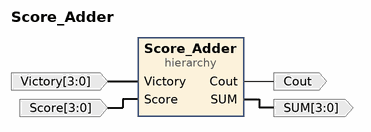
[diagram p0: block diagram of the top level]
# Vivado block design Score_Adder, xc7a35tcpg236-1, Vivado 2018.3
create_bd_design Score_Adder

create_bd_port -dir O Cout
create_bd_port -dir O -from 3 -to 0 SUM
create_bd_port -dir I -from 3 -to 0 Score
create_bd_port -dir I -from 3 -to 0 Victory

create_bd_cell -type hier Score_Adder

# ---- hierarchy /Score_Adder ----
current_bd_instance /Score_Adder
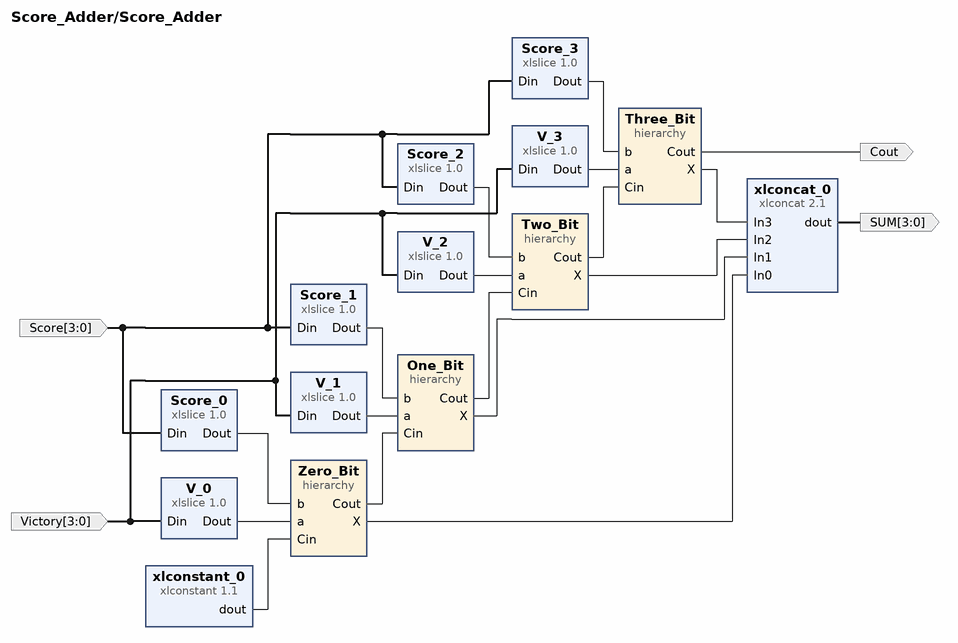
[diagram p1: block diagram inside /Score_Adder]
create_bd_pin -dir I -from 3 -to 0 Score
create_bd_pin -dir O -from 3 -to 0 SUM
create_bd_pin -dir I -from 3 -to 0 Victory
create_bd_pin -dir O Cout

create_bd_cell -type ip -vlnv xilinx.com:ip:xlslice:1.0 Score_0
set_property -dict {CONFIG.DIN_FROM 0 CONFIG.DIN_TO 0 CONFIG.DIN_WIDTH 4} [get_bd_cells Score_0]
create_bd_cell -type ip -vlnv xilinx.com:ip:xlslice:1.0 Score_1
set_property -dict {CONFIG.DIN_FROM 1 CONFIG.DIN_TO 1 CONFIG.DIN_WIDTH 4 CONFIG.DOUT_WIDTH 1} [get_bd_cells Score_1]
create_bd_cell -type ip -vlnv xilinx.com:ip:xlconcat:2.1 xlconcat_0
set_property -dict {CONFIG.NUM_PORTS 4} [get_bd_cells xlconcat_0]
create_bd_cell -type ip -vlnv xilinx.com:ip:xlslice:1.0 Score_2
set_property -dict {CONFIG.DIN_FROM 2 CONFIG.DIN_TO 2 CONFIG.DIN_WIDTH 4 CONFIG.DOUT_WIDTH 1} [get_bd_cells Score_2]
create_bd_cell -type ip -vlnv xilinx.com:ip:xlconstant:1.1 xlconstant_0
set_property -dict {CONFIG.CONST_VAL 0} [get_bd_cells xlconstant_0]
create_bd_cell -type ip -vlnv xilinx.com:ip:xlslice:1.0 Score_3
set_property -dict {CONFIG.DIN_FROM 3 CONFIG.DIN_TO 3 CONFIG.DIN_WIDTH 4 CONFIG.DOUT_WIDTH 1} [get_bd_cells Score_3]
create_bd_cell -type ip -vlnv xilinx.com:ip:xlslice:1.0 V_0
set_property -dict {CONFIG.DIN_FROM 0 CONFIG.DIN_TO 0 CONFIG.DIN_WIDTH 4} [get_bd_cells V_0]
create_bd_cell -type ip -vlnv xilinx.com:ip:xlslice:1.0 V_1
set_property -dict {CONFIG.DIN_FROM 1 CONFIG.DIN_TO 1 CONFIG.DIN_WIDTH 4 CONFIG.DOUT_WIDTH 1} [get_bd_cells V_1]
create_bd_cell -type ip -vlnv xilinx.com:ip:xlslice:1.0 V_2
set_property -dict {CONFIG.DIN_FROM 2 CONFIG.DIN_TO 2 CONFIG.DIN_WIDTH 4 CONFIG.DOUT_WIDTH 1} [get_bd_cells V_2]
create_bd_cell -type ip -vlnv xilinx.com:ip:xlslice:1.0 V_3
set_property -dict {CONFIG.DIN_FROM 3 CONFIG.DIN_TO 3 CONFIG.DIN_WIDTH 4 CONFIG.DOUT_WIDTH 1} [get_bd_cells V_3]
create_bd_cell -type hier One_Bit
create_bd_cell -type hier Three_Bit
create_bd_cell -type hier Zero_Bit
create_bd_cell -type hier Two_Bit

# ---- hierarchy /Score_Adder/One_Bit ----
current_bd_instance /Score_Adder/One_Bit
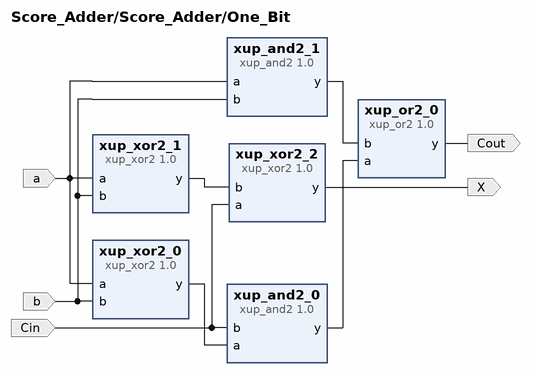
[diagram p2: block diagram inside /Score_Adder/One_Bit]
create_bd_pin -dir I a
create_bd_pin -dir I b
create_bd_pin -dir I Cin
create_bd_pin -dir O X
create_bd_pin -dir O Cout

create_bd_cell -type ip -vlnv xilinx.com:xup:xup_xor2:1.0 xup_xor2_0
set_property -dict {CONFIG.DELAY 0} [get_bd_cells xup_xor2_0]
create_bd_cell -type ip -vlnv xilinx.com:xup:xup_xor2:1.0 xup_xor2_1
set_property -dict {CONFIG.DELAY 0} [get_bd_cells xup_xor2_1]
create_bd_cell -type ip -vlnv xilinx.com:xup:xup_xor2:1.0 xup_xor2_2
set_property -dict {CONFIG.DELAY 0} [get_bd_cells xup_xor2_2]
create_bd_cell -type ip -vlnv xilinx.com:xup:xup_and2:1.0 xup_and2_0
create_bd_cell -type ip -vlnv xilinx.com:xup:xup_and2:1.0 xup_and2_1
create_bd_cell -type ip -vlnv xilinx.com:xup:xup_or2:1.0 xup_or2_0
set_property -dict {CONFIG.DELAY 0} [get_bd_cells xup_or2_0]

# ---- hierarchy /Score_Adder/Three_Bit ----
current_bd_instance /Score_Adder/Three_Bit
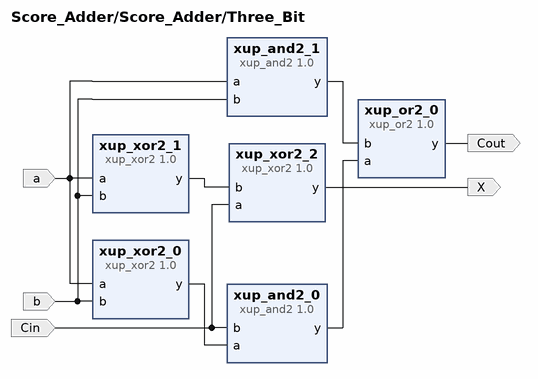
[diagram p3: block diagram inside /Score_Adder/Three_Bit]
create_bd_pin -dir I a
create_bd_pin -dir I b
create_bd_pin -dir I Cin
create_bd_pin -dir O X
create_bd_pin -dir O Cout

create_bd_cell -type ip -vlnv xilinx.com:xup:xup_xor2:1.0 xup_xor2_0
set_property -dict {CONFIG.DELAY 0} [get_bd_cells xup_xor2_0]
create_bd_cell -type ip -vlnv xilinx.com:xup:xup_xor2:1.0 xup_xor2_1
set_property -dict {CONFIG.DELAY 0} [get_bd_cells xup_xor2_1]
create_bd_cell -type ip -vlnv xilinx.com:xup:xup_xor2:1.0 xup_xor2_2
set_property -dict {CONFIG.DELAY 0} [get_bd_cells xup_xor2_2]
create_bd_cell -type ip -vlnv xilinx.com:xup:xup_and2:1.0 xup_and2_0
create_bd_cell -type ip -vlnv xilinx.com:xup:xup_and2:1.0 xup_and2_1
create_bd_cell -type ip -vlnv xilinx.com:xup:xup_or2:1.0 xup_or2_0
set_property -dict {CONFIG.DELAY 0} [get_bd_cells xup_or2_0]

# ---- hierarchy /Score_Adder/Zero_Bit ----
current_bd_instance /Score_Adder/Zero_Bit
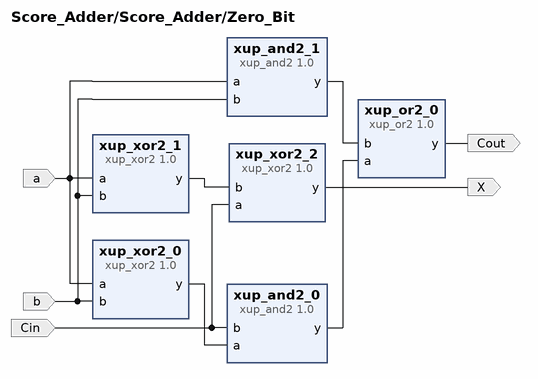
[diagram p4: block diagram inside /Score_Adder/Zero_Bit]
create_bd_pin -dir I a
create_bd_pin -dir I b
create_bd_pin -dir I Cin
create_bd_pin -dir O X
create_bd_pin -dir O Cout

create_bd_cell -type ip -vlnv xilinx.com:xup:xup_xor2:1.0 xup_xor2_0
set_property -dict {CONFIG.DELAY 0} [get_bd_cells xup_xor2_0]
create_bd_cell -type ip -vlnv xilinx.com:xup:xup_xor2:1.0 xup_xor2_1
set_property -dict {CONFIG.DELAY 0} [get_bd_cells xup_xor2_1]
create_bd_cell -type ip -vlnv xilinx.com:xup:xup_xor2:1.0 xup_xor2_2
set_property -dict {CONFIG.DELAY 0} [get_bd_cells xup_xor2_2]
create_bd_cell -type ip -vlnv xilinx.com:xup:xup_and2:1.0 xup_and2_0
create_bd_cell -type ip -vlnv xilinx.com:xup:xup_and2:1.0 xup_and2_1
create_bd_cell -type ip -vlnv xilinx.com:xup:xup_or2:1.0 xup_or2_0
set_property -dict {CONFIG.DELAY 0} [get_bd_cells xup_or2_0]

# ---- hierarchy /Score_Adder/Two_Bit ----
current_bd_instance /Score_Adder/Two_Bit
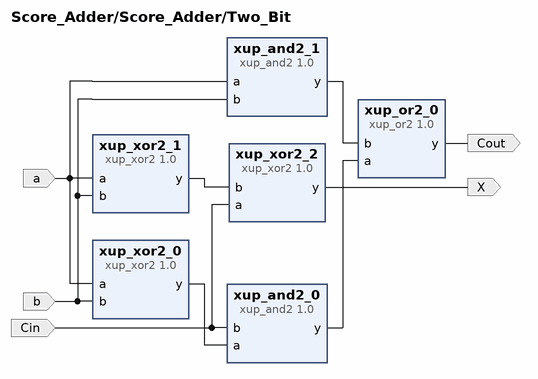
[diagram p5: block diagram inside /Score_Adder/Two_Bit]
create_bd_pin -dir I a
create_bd_pin -dir I b
create_bd_pin -dir I Cin
create_bd_pin -dir O X
create_bd_pin -dir O Cout

create_bd_cell -type ip -vlnv xilinx.com:xup:xup_xor2:1.0 xup_xor2_0
set_property -dict {CONFIG.DELAY 0} [get_bd_cells xup_xor2_0]
create_bd_cell -type ip -vlnv xilinx.com:xup:xup_xor2:1.0 xup_xor2_1
set_property -dict {CONFIG.DELAY 0} [get_bd_cells xup_xor2_1]
create_bd_cell -type ip -vlnv xilinx.com:xup:xup_xor2:1.0 xup_xor2_2
set_property -dict {CONFIG.DELAY 0} [get_bd_cells xup_xor2_2]
create_bd_cell -type ip -vlnv xilinx.com:xup:xup_and2:1.0 xup_and2_0
create_bd_cell -type ip -vlnv xilinx.com:xup:xup_and2:1.0 xup_and2_1
create_bd_cell -type ip -vlnv xilinx.com:xup:xup_or2:1.0 xup_or2_0
set_property -dict {CONFIG.DELAY 0} [get_bd_cells xup_or2_0]

# ---- connections ----

current_bd_instance /Score_Adder
connect_bd_net [get_bd_pins Score_0/Dout] [get_bd_pins Zero_Bit/b]
connect_bd_net [get_bd_pins Score_1/Dout] [get_bd_pins One_Bit/b]
connect_bd_net [get_bd_pins Zero_Bit/X] [get_bd_pins xlconcat_0/In0]
connect_bd_net [get_bd_pins One_Bit/X] [get_bd_pins xlconcat_0/In1]
connect_bd_net [get_bd_pins Two_Bit/X] [get_bd_pins xlconcat_0/In2]
connect_bd_net [get_bd_pins Three_Bit/X] [get_bd_pins xlconcat_0/In3]
connect_bd_net [get_bd_pins Score_2/Dout] [get_bd_pins Two_Bit/b]
connect_bd_net [get_bd_pins xlconstant_0/dout] [get_bd_pins Zero_Bit/Cin]
connect_bd_net [get_bd_pins Score_3/Dout] [get_bd_pins Three_Bit/b]
connect_bd_net [get_bd_pins V_0/Dout] [get_bd_pins Zero_Bit/a]
connect_bd_net [get_bd_pins V_1/Dout] [get_bd_pins One_Bit/a]
connect_bd_net [get_bd_pins V_2/Dout] [get_bd_pins Two_Bit/a]
connect_bd_net [get_bd_pins V_3/Dout] [get_bd_pins Three_Bit/a]
connect_bd_net [get_bd_pins Zero_Bit/Cout] [get_bd_pins One_Bit/Cin]
connect_bd_net [get_bd_pins One_Bit/Cout] [get_bd_pins Two_Bit/Cin]
connect_bd_net [get_bd_pins Two_Bit/Cout] [get_bd_pins Three_Bit/Cin]
connect_bd_net [get_bd_pins Score] [get_bd_pins Score_1/Din] [get_bd_pins Score_2/Din] [get_bd_pins Score_3/Din] [get_bd_pins Score_0/Din]
connect_bd_net [get_bd_pins xlconcat_0/dout] [get_bd_pins SUM]
connect_bd_net [get_bd_pins Victory] [get_bd_pins V_1/Din] [get_bd_pins V_2/Din] [get_bd_pins V_3/Din] [get_bd_pins V_0/Din]
connect_bd_net [get_bd_pins Three_Bit/Cout] [get_bd_pins Cout]

current_bd_instance /Score_Adder/One_Bit
connect_bd_net [get_bd_pins xup_xor2_0/y] [get_bd_pins xup_and2_0/a]
connect_bd_net [get_bd_pins xup_xor2_1/y] [get_bd_pins xup_xor2_2/b]
connect_bd_net [get_bd_pins xup_and2_0/y] [get_bd_pins xup_or2_0/a]
connect_bd_net [get_bd_pins xup_and2_1/y] [get_bd_pins xup_or2_0/b]
connect_bd_net [get_bd_pins a] [get_bd_pins xup_xor2_1/a] [get_bd_pins xup_and2_1/a] [get_bd_pins xup_xor2_0/a]
connect_bd_net [get_bd_pins b] [get_bd_pins xup_xor2_1/b] [get_bd_pins xup_and2_1/b] [get_bd_pins xup_xor2_0/b]
connect_bd_net [get_bd_pins Cin] [get_bd_pins xup_and2_0/b] [get_bd_pins xup_xor2_2/a]
connect_bd_net [get_bd_pins xup_xor2_2/y] [get_bd_pins X]
connect_bd_net [get_bd_pins xup_or2_0/y] [get_bd_pins Cout]

current_bd_instance /Score_Adder/Three_Bit
connect_bd_net [get_bd_pins xup_xor2_0/y] [get_bd_pins xup_and2_0/a]
connect_bd_net [get_bd_pins xup_xor2_1/y] [get_bd_pins xup_xor2_2/b]
connect_bd_net [get_bd_pins xup_and2_0/y] [get_bd_pins xup_or2_0/a]
connect_bd_net [get_bd_pins xup_and2_1/y] [get_bd_pins xup_or2_0/b]
connect_bd_net [get_bd_pins a] [get_bd_pins xup_xor2_1/a] [get_bd_pins xup_and2_1/a] [get_bd_pins xup_xor2_0/a]
connect_bd_net [get_bd_pins b] [get_bd_pins xup_xor2_1/b] [get_bd_pins xup_and2_1/b] [get_bd_pins xup_xor2_0/b]
connect_bd_net [get_bd_pins Cin] [get_bd_pins xup_and2_0/b] [get_bd_pins xup_xor2_2/a]
connect_bd_net [get_bd_pins xup_xor2_2/y] [get_bd_pins X]
connect_bd_net [get_bd_pins xup_or2_0/y] [get_bd_pins Cout]

current_bd_instance /Score_Adder/Zero_Bit
connect_bd_net [get_bd_pins xup_xor2_0/y] [get_bd_pins xup_and2_0/a]
connect_bd_net [get_bd_pins xup_xor2_1/y] [get_bd_pins xup_xor2_2/b]
connect_bd_net [get_bd_pins xup_and2_0/y] [get_bd_pins xup_or2_0/a]
connect_bd_net [get_bd_pins xup_and2_1/y] [get_bd_pins xup_or2_0/b]
connect_bd_net [get_bd_pins a] [get_bd_pins xup_xor2_1/a] [get_bd_pins xup_and2_1/a] [get_bd_pins xup_xor2_0/a]
connect_bd_net [get_bd_pins b] [get_bd_pins xup_xor2_1/b] [get_bd_pins xup_and2_1/b] [get_bd_pins xup_xor2_0/b]
connect_bd_net [get_bd_pins Cin] [get_bd_pins xup_and2_0/b] [get_bd_pins xup_xor2_2/a]
connect_bd_net [get_bd_pins xup_xor2_2/y] [get_bd_pins X]
connect_bd_net [get_bd_pins xup_or2_0/y] [get_bd_pins Cout]

current_bd_instance /Score_Adder/Two_Bit
connect_bd_net [get_bd_pins xup_xor2_0/y] [get_bd_pins xup_and2_0/a]
connect_bd_net [get_bd_pins xup_xor2_1/y] [get_bd_pins xup_xor2_2/b]
connect_bd_net [get_bd_pins xup_and2_0/y] [get_bd_pins xup_or2_0/a]
connect_bd_net [get_bd_pins xup_and2_1/y] [get_bd_pins xup_or2_0/b]
connect_bd_net [get_bd_pins a] [get_bd_pins xup_xor2_1/a] [get_bd_pins xup_and2_1/a] [get_bd_pins xup_xor2_0/a]
connect_bd_net [get_bd_pins b] [get_bd_pins xup_xor2_1/b] [get_bd_pins xup_and2_1/b] [get_bd_pins xup_xor2_0/b]
connect_bd_net [get_bd_pins Cin] [get_bd_pins xup_and2_0/b] [get_bd_pins xup_xor2_2/a]
connect_bd_net [get_bd_pins xup_xor2_2/y] [get_bd_pins X]
connect_bd_net [get_bd_pins xup_or2_0/y] [get_bd_pins Cout]

current_bd_instance /
connect_bd_net -net Three_Bit_Cout [get_bd_pins Score_Adder/Cout] [get_bd_ports Cout]
connect_bd_net -net xlconcat_0_dout [get_bd_pins Score_Adder/SUM] [get_bd_ports SUM]
connect_bd_net [get_bd_ports Victory] [get_bd_pins Score_Adder/Victory]
connect_bd_net [get_bd_ports Score] [get_bd_pins Score_Adder/Score]

validate_bd_design
save_bd_design
